# Altium schematic sheet EdgeDetector.SchDoc
size A
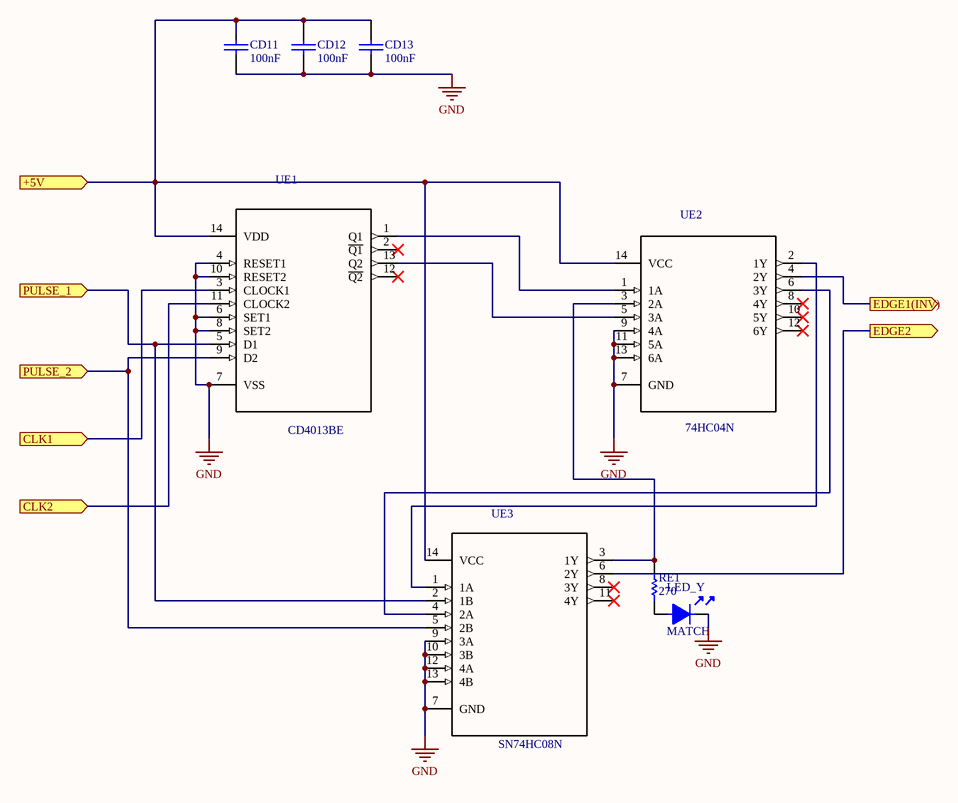
[diagram p0: EdgeDetector.SchDoc]

## Parts
CD11  100nF  [0805]
CD12  100nF  [0805]
CD13  100nF  [0805]
LED_Y  MATCH  [LED3]
RE1  270  [0805]
UE1  CD4013BE  [*DIP254P762X508-14]
UE2  74HC04N  [*DIP254P762X420-14]
UE3  SN74HC08N  [*DIP254P762X508-14]

## Ports
+5V (in), CLK1 (in), CLK2 (in), EDGE1(INV) (out), EDGE2 (out), PULSE_1 (in), PULSE_2 (in)

## Nets
GND: CD11.2 CD12.2 CD13.2 LED_Y.2 UE1.4(RESET1) UE1.6(SET1) UE1.7(VSS) UE1.8(SET2) UE1.10(RESET2) UE2.7(GND) UE2.9(4A) UE2.11(5A) UE2.13(6A) UE3.7(GND) UE3.9(3A) UE3.10(3B) UE3.12(4A) UE3.13(4B)
+5V: CD11.1 CD12.1 CD13.1 UE1.14(VDD) UE2.14(VCC) UE3.14(VCC) ; port +5V
CLK1: UE1.3(CLOCK1) ; port CLK1
CLK2: UE1.11(CLOCK2) ; port CLK2
EDGE1(INV): UE2.4(2Y) ; port EDGE1(INV)
EDGE2: UE3.6(2Y) ; port EDGE2
PULSE_1: UE1.5(D1) UE3.2(1B) ; port PULSE_1
PULSE_2: UE1.9(D2) UE3.5(2B) ; port PULSE_2
NetLED_Y_1: LED_Y.1 RE1.1
NetRE1_2: RE1.2 UE2.3(2A) UE3.3(1Y)
NetUE1_1: UE1.1(Q1) UE2.1(1A)
NetUE1_13: UE1.13(Q2) UE2.5(3A)
NetUE2_2: UE2.2(1Y) UE3.1(1A)
NetUE2_6: UE2.6(3Y) UE3.4(2A)

Not connected (* = marked no-connect by the designer): UE1 2(~{Q1})* 12(~{Q2})*; UE2 8(4Y)* 10(5Y)* 12(6Y)*; UE3 8(3Y)* 11(4Y)*

## Library data of the parts
CD11-CD13 = CAP
LED_Y = LED
RE1 = RES
UE1 = CD4013BE: Flip Flop D-Type Pos-Edge 2-Element 14-Pin PDIP; MF: Texas; Package: DIP-14 RCA; Availability: Unavailable; MP: CD4013BE; SnapEDA_Link: https://www.snapeda.com/parts/CD4013BE/Texas%20Instruments/view-part/?ref=snap; Price: None; Value: *
UE2 = 74HC04N: Inverter 6-Element CMOS 14-Pin PDIP Inverter 6-Element CMOS 14-Pin PDIP; MF: Texas Instruments; Price: None; SnapEDA_Link: https://www.snapeda.com/parts/74HC04N/Texas%20Instruments/view-part/?ref=snap; MP: 74HC04N; Package: DIP-14 NXP Semiconductors; Availability: Unavailable; Value: *
UE3 = SN74HC08N: AND Gate 4-Element 2-IN CMOS 14-Pin PDIP Tube; MF: Texas Instruments; SnapEDA_Link: https://www.snapeda.com/parts/SN74HC08N/Texas%20Instruments/view-part/?ref=snap; Price: None; MP: SN74HC08N; Availability: Unavailable; Package: PDIP-14 Signetics; Value: *